# EAGLE design xaef V0 (EAGLE 7.4.0)
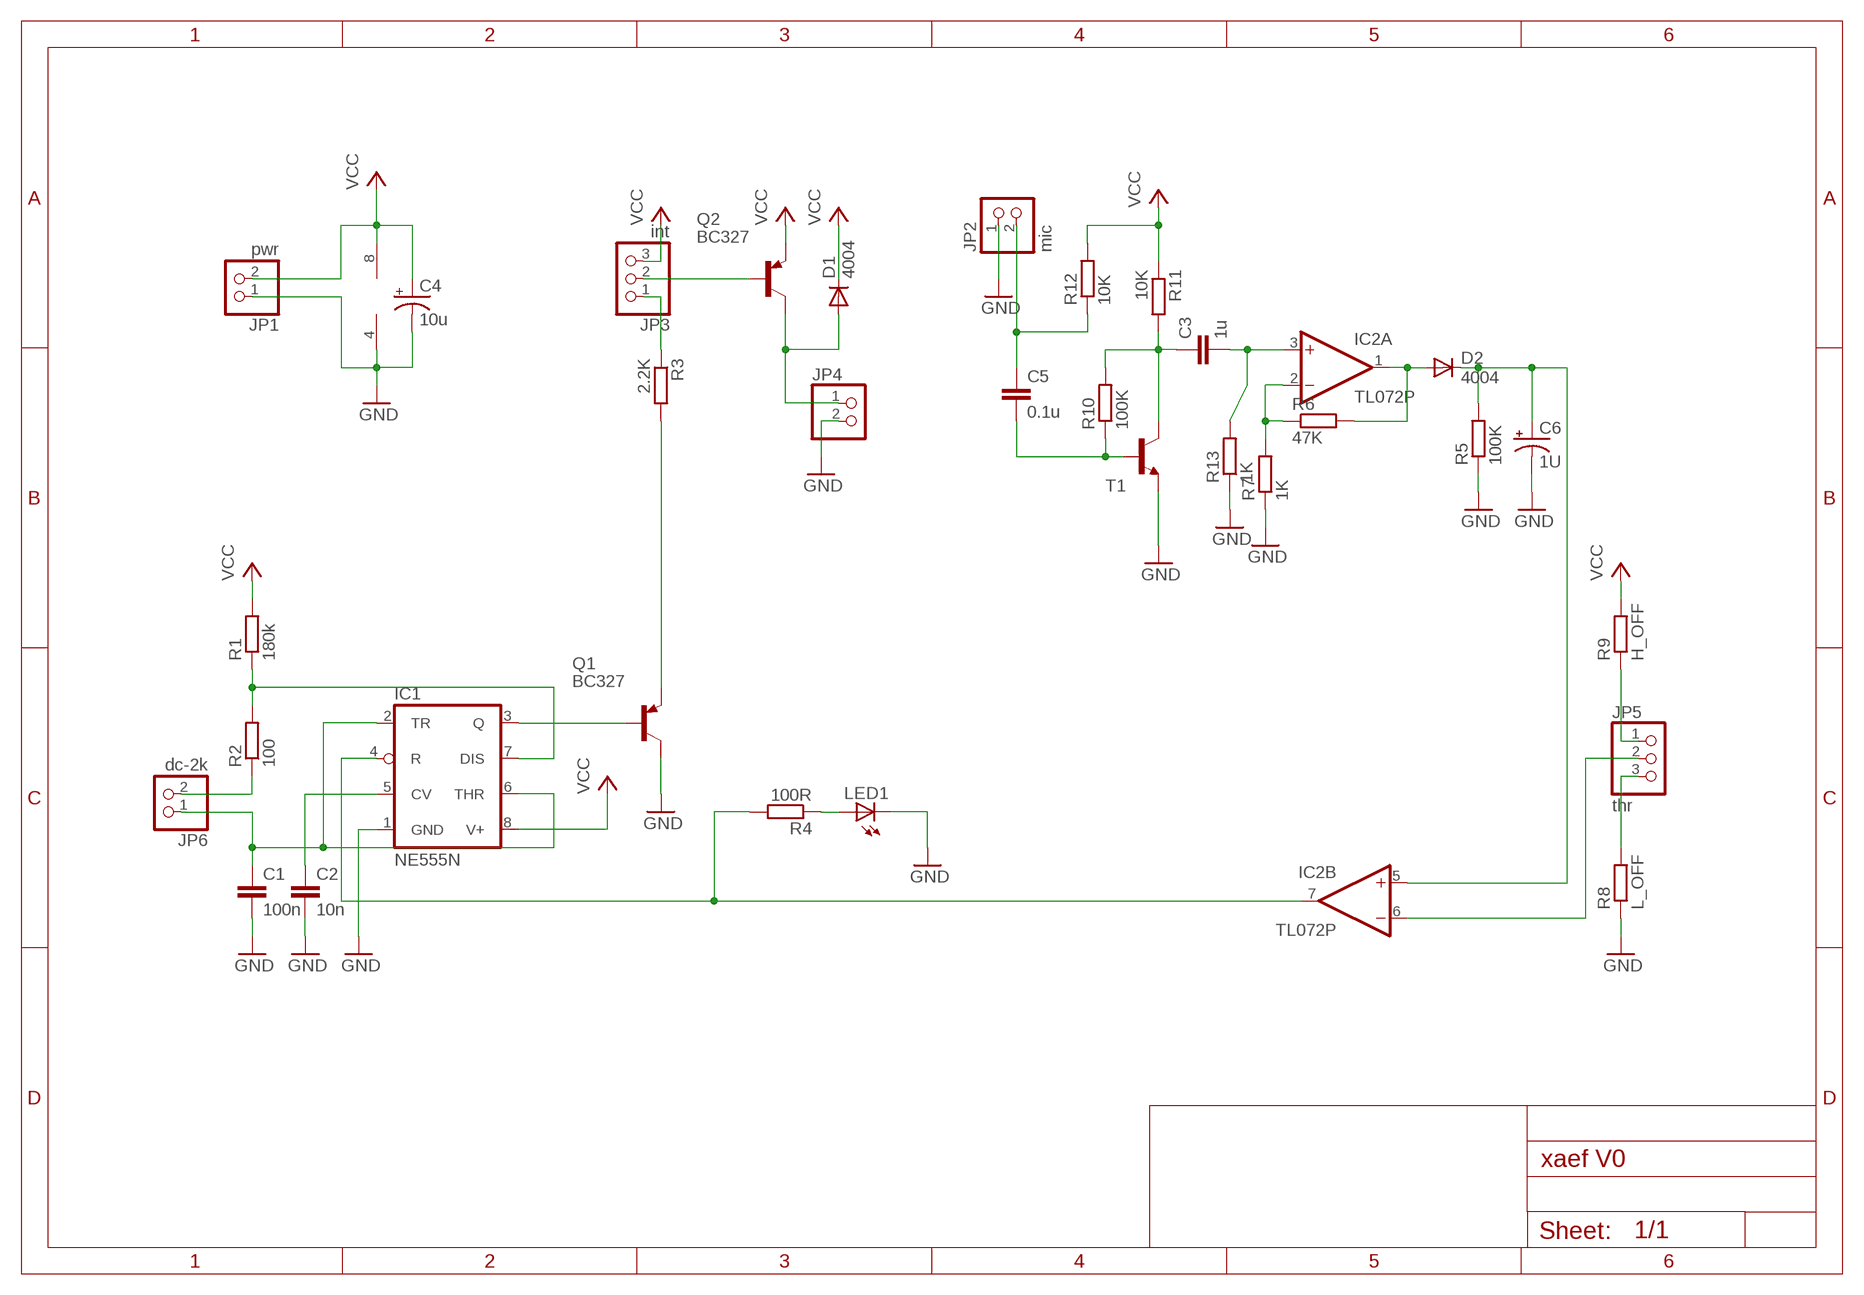
[diagram p0: schematic, sheet 1]

## Parts
C1  100n  C-EU050-030X075  [C050-030X075]
C2  10n  C-EU050-030X075  [C050-030X075]
C3  1u  C-EU050-030X075  [C050-030X075]
C4  10u  CPOL-USE3.5-8  [E3,5-8]
C5  0.1u  C-EU050-025X075  [C050-025X075]
C6  1U  CPOL-USE3.5-8  [E3,5-8]
D1  4004  DIODE-D-2.5  [D-2.5]
D2  4004  DIODE-D-2.5  [D-2.5]
IC1  NE555N  [DIL08-ROUND]
IC2  TL072P  [DIL08]
JP1  pwr  PINHD-1X2  [1X02]
JP2  mic  PINHD-1X2  [1X02]
JP3  int  PINHD-1X3  [1X03]
JP4  PINHD-1X2  [1X02]
JP5  thr  PINHD-1X3  [1X03]
JP6  dc-2k  PINHD-1X2  [1X02]
LED1  LED5MM  [LED5MM]
Q1  BC327  BC327-25  [TO92-EBC]
Q2  BC327  BC327-25  [TO92-EBC]
R1  180k  R-EU_0207/2V  [0207/2V]
R2  100  R-EU_0207/2V  [0207/2V]
R3  2.2K  R-EU_0207/2V  [0207/2V]
R4  100R  R-EU_0207/2V  [0207/2V]
R5  100K  R-EU_0207/2V  [0207/2V]
R6  47K  R-EU_0207/2V  [0207/2V]
R7  1K  R-EU_0207/2V  [0207/2V]
R8  L_OFF  R-EU_0207/2V  [0207/2V]
R9  H_OFF  R-EU_0207/2V  [0207/2V]
R10  100K  R-EU_0207/2V  [0207/2V]
R11  10K  R-EU_0207/2V  [0207/2V]
R12  10K  R-EU_0207/2V  [0207/2V]
R13  1K  R-EU_0207/2V  [0207/2V]
T1  2N3904-NPN-TO92-EBC  [TO92-EBC]

## Nets
GND: C1.2 C2.2 C4.- C6.- IC1.1(GND) IC2.4(P:V-) JP1.1 JP2.1 JP4.2 LED1.K(C) Q1.C R5.1 R7.1 R8.1 R13.1 T1.E
N$1: IC1.7(DIS) R1.1 R2.2
N$2: IC1.3(Q) Q1.B
N$3: JP3.2 Q2.B
N$4: Q1.E R3.2
N$5: D1.A JP4.1 Q2.C
N$6: C2.1 IC1.5(CV)
N$7: C1.1 IC1.2(TR) IC1.6(THR) JP6.1
N$8: LED1.A R4.1
N$9: IC1.4(R) IC2.7(B:OUT) R4.2
N$10: JP3.1 R3.1
N$11: IC2.2(A:-IN) R6.1 R7.2
N$12: JP6.2 R2.1
N$13: D2.A IC2.1(A:OUT) R6.2
N$14: C3.2 IC2.3(A:+IN) R13.2
N$15: C3.1 R10.2 R11.2 T1.C
N$16: JP5.3 R8.2
N$17: JP5.1 R9.1
N$18: C5.2 R10.1 T1.B
N$19: IC2.6(B:-IN) JP5.2
N$20: C6.+ D2.C IC2.5(B:+IN) R5.2
N$22: C5.1 JP2.2 R12.1
VCC: C4.+ D1.C IC1.8(V+) IC2.8(P:V+) JP1.2 JP3.3 Q2.E R1.2 R9.2 R11.1 R12.2

## Library data of the parts
C1-C3 = resistor:C-EU: CAPACITOR, European symbol
C4 C6 = adafruit:CPOL-US: POLARIZED CAPACITOR, American symbol
C5 = rcl:C-EU: CAPACITOR, European symbol
D1 D2 = diode:DIODE-: DIODE
IC1 = adafruit:*555: TIMER Changed DIP package to have round (not oval) pin pads http://www.ladyada.net/library/pcb/eaglelibrary.html
IC2 = linear:TL072: OP AMP
JP1 JP2 JP4 JP6 = pinhead:PINHD-1X2: PIN HEADER
JP3 JP5 = adafruit:PINHD-1X3: PIN HEADER
LED1 = adafruit:LED: LED OSRAM: - CHIPLED LG R971, LG N971, LY N971, LG Q971, LY Q971, LO R971, LY R971 LH N974, LH R974 LS Q976, LO Q976, LY Q976 LO Q996 - Hyper CHIPLED LW Q18S LB Q993, LB Q99A, LB R99A - SideLED LS A670, LO A670, LY A670, LG A670, LP A670 LB A673, LV A673, LT A673, LW A673 LH A674 LY A675 LS A676, LA A676, LO A676, LY A676, LW A676 LS A679, LY A679, LG A679 - Hyper Micro SIDELED® LS Y876, LA Y876, LO Y876, LY Y876 LT Y87S - SmartLED LW L88C, LW L88S LB L89C, LB L89S, LG L890 LS L89K, LO L89K, LY L89K LS L896, LA L896, LO L896, LY L896 - TOPLED LS T670, LO T670, LY T670, LG T670, LP T670 LSG T670, LSP T670, LSY T670, LOP T670, LYG T670 LG T671, LOG T671, LSG T671 LB T673, LV T673, LT T673, LW T673 LH T674 LS T676, LA T676, LO T676, LY T676, LB T676, LH T676, LSB T676, LW T676 LB T67C, LV T67C, LT T67C, LS T67K, LO T67K, LY T67K, LW E67C LS E67B, LA E67B, LO E67B, LY E67B, LB E67C, LV E67C, LT E67C LW T67C LS T679, LY T679, LG T679 LS T770, LO T770, LY T770, LG T770, LP T770 LB T773, LV T773, LT T773, LW T773 LH T774 LS E675, LA E675, LY E675, LS T675 LS T776, LA T776, LO T776, LY T776, LB T776 LHGB T686 LT T68C, LB T68C - Hyper Mini TOPLED® LB M676 - Mini TOPLED Santana® LG M470 LS M47K, LO M47K, LY M47K Source: http://www.osram.convergy.de/
Q1 Q2 = transistor-pnp:BC327*: PNP Transistror
R1-R13 = resistor:R-EU_: RESISTOR, European symbol
T1 = transistor-neu-to92:*-NPN-: NPN Transistror

## Board
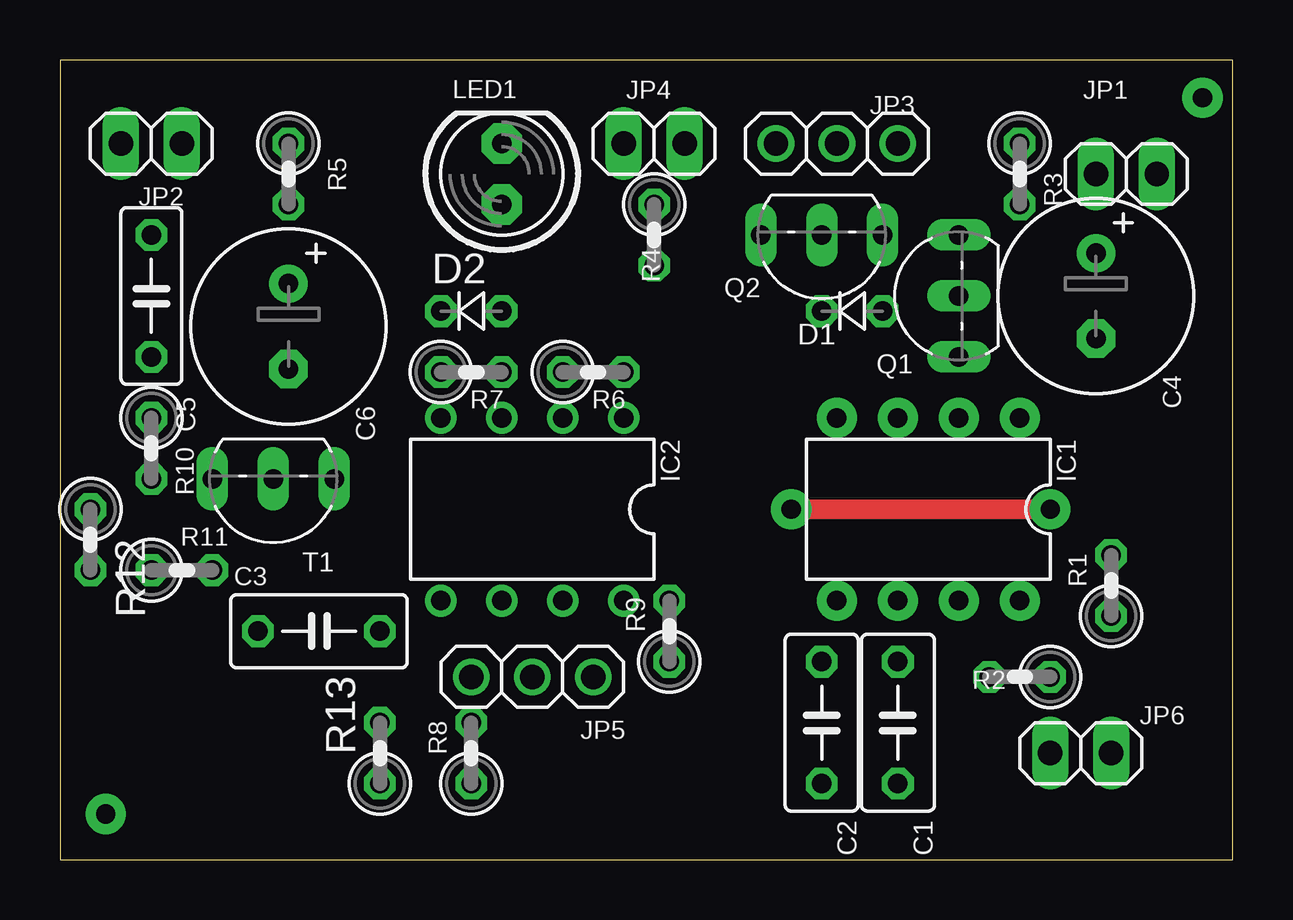
[diagram p1: board, top side]
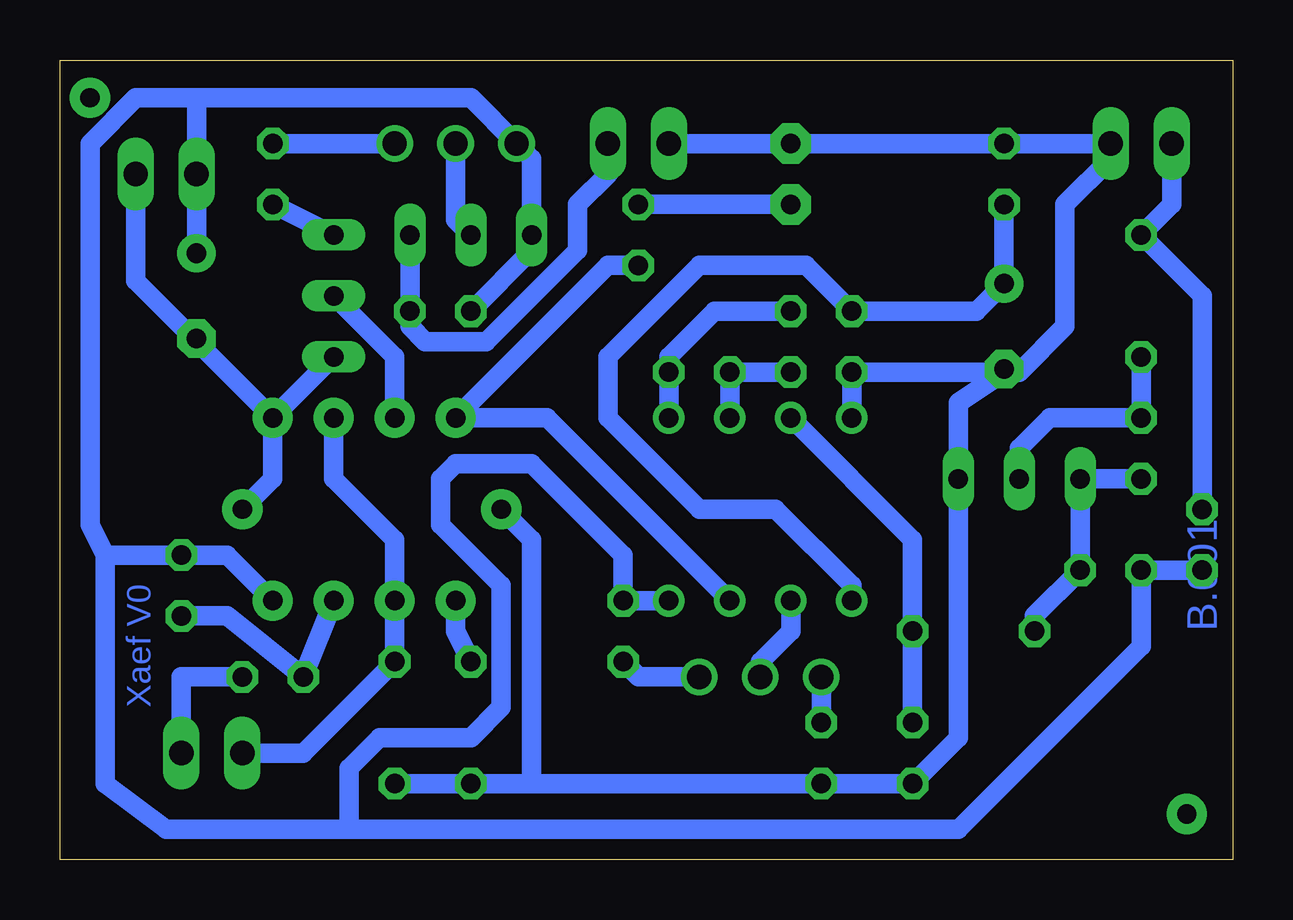
[diagram p2: board, bottom side, seen from below]

Size 48.88 x 33.33 mm. Coordinates in mm from the lower left corner, seen from the top.
Outline: 0,0 48.88,0 48.88,33.33 0,33.33 0,0
Copper layers (1*16): Top 0.035mm / dielectric 1.5mm / Bottom 0.035mm
Design rules "default": minimum track width 10mil, minimum drill 24mil, track to track 8mil, track to pad 8mil, pad to pad 8mil, via to via 8mil, smd to smd 8mil, copper to edge 40mil, drill to drill 8mil, minimum pad ring 10mil, minimum via ring 8mil, stop-mask expansion 4mil, vias tented up to drill 0mil, thermal gap 10mil

### Footprints (pad centres in the part's own frame; a part is rotated, then mirrored left to right if it is on the bottom)
C050-030X075 = drill 0.813 octagon: 1 -2.54,0; 2 2.54,0
E3,5-8 = drill 0.813 pad 1.6: + -1.778,0 | drill 0.813 pad 1.6 octagon: - 1.778,0
C050-025X075 = drill 0.813 octagon: 1 -2.54,0; 2 2.54,0
D-2.5 = drill 0.813 octagon: A 1.27,0; C -1.27,0
DIL08-ROUND = drill 0.813 pad 1.676: 1 -3.81,-3.81; 2 -1.27,-3.81; 3 1.27,-3.81; 4 3.81,-3.81; 5 3.81,3.81; 6 1.27,3.81; 7 -1.27,3.81; 8 -3.81,3.81
DIL08 = drill 0.813 pad 1.27: 1 -3.81,-3.81; 2 -1.27,-3.81; 3 1.27,-3.81; 4 3.81,-3.81; 5 3.81,3.81; 6 1.27,3.81; 7 -1.27,3.81; 8 -3.81,3.81
1X02 = drill 1.016 long: 1 -1.27,0; 2 1.27,0
1X03 = drill 1.016: 1 -2.54,0; 2 0,0; 3 2.54,0
LED5MM = drill 0.813 pad 1.676 octagon: A -1.27,0; K 1.27,0
TO92-EBC = drill 0.813 long: B 0,-1.27; C -2.54,-1.27; E 2.54,-1.27
0207/2V = drill 0.813 octagon: 1 -1.27,0; 2 1.27,0
TO92-EBC' = drill 0.813 long: B 0,-1.27; C 2.54,-1.27; E -2.54,-1.27

### Placement (x,y rotation side)
C1  34.92,5.71 270 top
C2  31.75,5.71 270 top
C3  10.79,9.53 0 top
C4  43.18,23.5 270 top
C5  3.81,23.5 270 top
C6  9.53,22.23 270 top
D1  33.02,22.86 0 top
D2  17.14,22.86 0 top
IC1  36.2,14.61 180 top
IC2  19.68,14.61 180 top
JP1  44.45,28.57 180 top
JP2  3.81,29.84 180 top
JP3  32.38,29.84 180 top
JP4  24.77,29.84 180 top
JP5  19.68,7.62 180 top
JP6  42.55,4.45 0 top
LED1  18.41,28.57 90 top
Q1  36.2,23.5 90 top
Q2  31.75,24.77 180 top
R1  43.81,11.43 90 top
R2  40.01,7.62 180 top
R3  40.01,28.57 270 top
R4  24.77,26.04 270 top
R5  9.53,28.57 270 top
R6  22.23,20.32 0 top
R7  17.14,20.32 0 top
R8  17.14,4.45 90 top
R9  25.4,9.53 90 top
R10  3.81,17.14 270 top
R11  5.08,12.06 0 top
R12  1.27,13.34 270 top
R13  13.34,4.45 90 top
T1  [TO92-EBC']  8.89,14.61 180 top

### Tracks (layer width: path | path; a pad name or v marks a point on that pad's centre or on a via)
GND  (via drill 0.8 pad 1.68)
  Top 0.813: v30.48,14.61 v41.27,14.61
  Bottom 0.813: IC1.1 40.01,15.88 v41.27,14.61 | JP4.2 LED1.K R5.1 JP2.1 5.08,29.21 6.99,27.3 6.99,22.23 8.89,20.32 9.4,20.32 C6.- 9.53,20.32 | IC2.4 R7.1 9.53,20.32 | 9.53,20.32 11.43,19.05 T1.E 11.43,5.08 R13.1 R8.1 | R8.1 16.51,3.17 | R8.1 29.21,3.17 | 29.21,3.17 C2.2 C1.2 | 29.21,3.17 29.21,13.34 v30.48,14.61 | JP1.1 45.72,24.13 43.31,21.72 C4.- 43.18,21.59 IC1.1 | IC1.1 Q1.C
N$1
  Bottom 0.813: R1.1 41.91,10.16 R2.2 IC1.7
N$2
  Bottom 0.813: Q1.B 34.92,20.95 IC1.3
N$3
  Bottom 0.813: JP3.2 32.38,26.67 Q2.B
N$4
  Bottom 0.813: R3.2 Q1.E
N$5
  Bottom 0.813: Q2.C D1.A 34.29,22.23 33.66,21.59 31.11,21.59 27.3,25.4 27.3,27.3 26.04,28.57 JP4.1
N$6
  Bottom 0.813: IC1.5 32.38,9.53 C2.1
N$7
  Bottom 0.813: IC1.2 37.47,15.88 34.92,13.34 IC1.6 C1.1 38.73,4.45 JP6.1
N$8
  Bottom 0.813: R4.1 LED1.A
N$9
  Bottom 0.813: R4.2 26.04,24.77 IC1.4 28.57,18.41 IC2.7
N$10
  Bottom 0.813: R3.1 JP3.1
N$11
  Bottom 0.813: IC2.2 R6.1 R7.2
N$12
  Bottom 0.813: R2.1 43.81,7.62 JP6.2
N$13
  Bottom 0.813: IC2.1 R6.2 23.5,20.95 21.59,22.86 D2.A
N$14
  Bottom 0.813: IC2.3 13.34,13.34 C3.2 R13.2
N$15
  Bottom 0.813: R10.2 T1.C R11.2 8.26,10.16 C3.1
N$16
  Bottom 0.813: R8.2 JP5.3
N$17
  Bottom 0.813: JP5.1 24.77,7.62 R9.1
N$18
  Bottom 0.813: C5.2 R10.1 7.62,18.41 8.89,17.14 T1.B
N$19
  Bottom 0.813: IC2.6 18.41,9.53 19.68,8.26 JP5.2
N$20
  Bottom 0.813: R5.2 C6.+ 10.67,22.86 D2.C 17.78,24.77 22.23,24.77 26.04,20.95 26.04,18.41 22.23,14.61 19.05,14.61 15.88,11.43 IC2.5
N$22
  Bottom 0.813: JP2.2 2.54,27.3 C5.1 1.27,23.5 R12.1
N$23  (via drill 0.8 pad 1.68)
  other vias: 1.91,1.91
N$24  (via drill 0.8 pad 1.68)
  other vias: 47.62,31.75
VCC
  Bottom 0.813: IC2.8 R9.2 25.4,12.7 29.21,16.51 32.38,16.51 33.02,15.88 33.02,13.97 30.48,11.43 30.48,6.35 31.75,5.08 35.56,5.08 36.83,3.81 36.83,1.27 | 36.83,1.27 11.43,1.27 3.81,8.89 R11.1 R12.2 | 36.83,1.27 44.45,1.27 46.99,3.17 46.99,12.7 | D1.C 29.21,25.4 Q2.E 29.21,29.21 JP3.3 31.75,31.75 43.18,31.75 | 43.18,31.75 45.72,31.75 47.62,29.84 47.62,13.97 46.99,12.7 | C4.+ JP1.2 43.18,31.75 | 46.99,12.7 R1.2 41.91,12.7 IC1.8

### Text on the board
Bottom: B.001 | Xaef V0